# Altium project CompleteController.PrjPcb (part 2 of 2)

## Sheet SH5 - ARMCONTROLS.SchDoc
size Letter; Organization: UW Robotics; Address1: 200 University Avenue; Address2: Waterloo; Address3: Ontario; Address4: Canada N2L 3G6
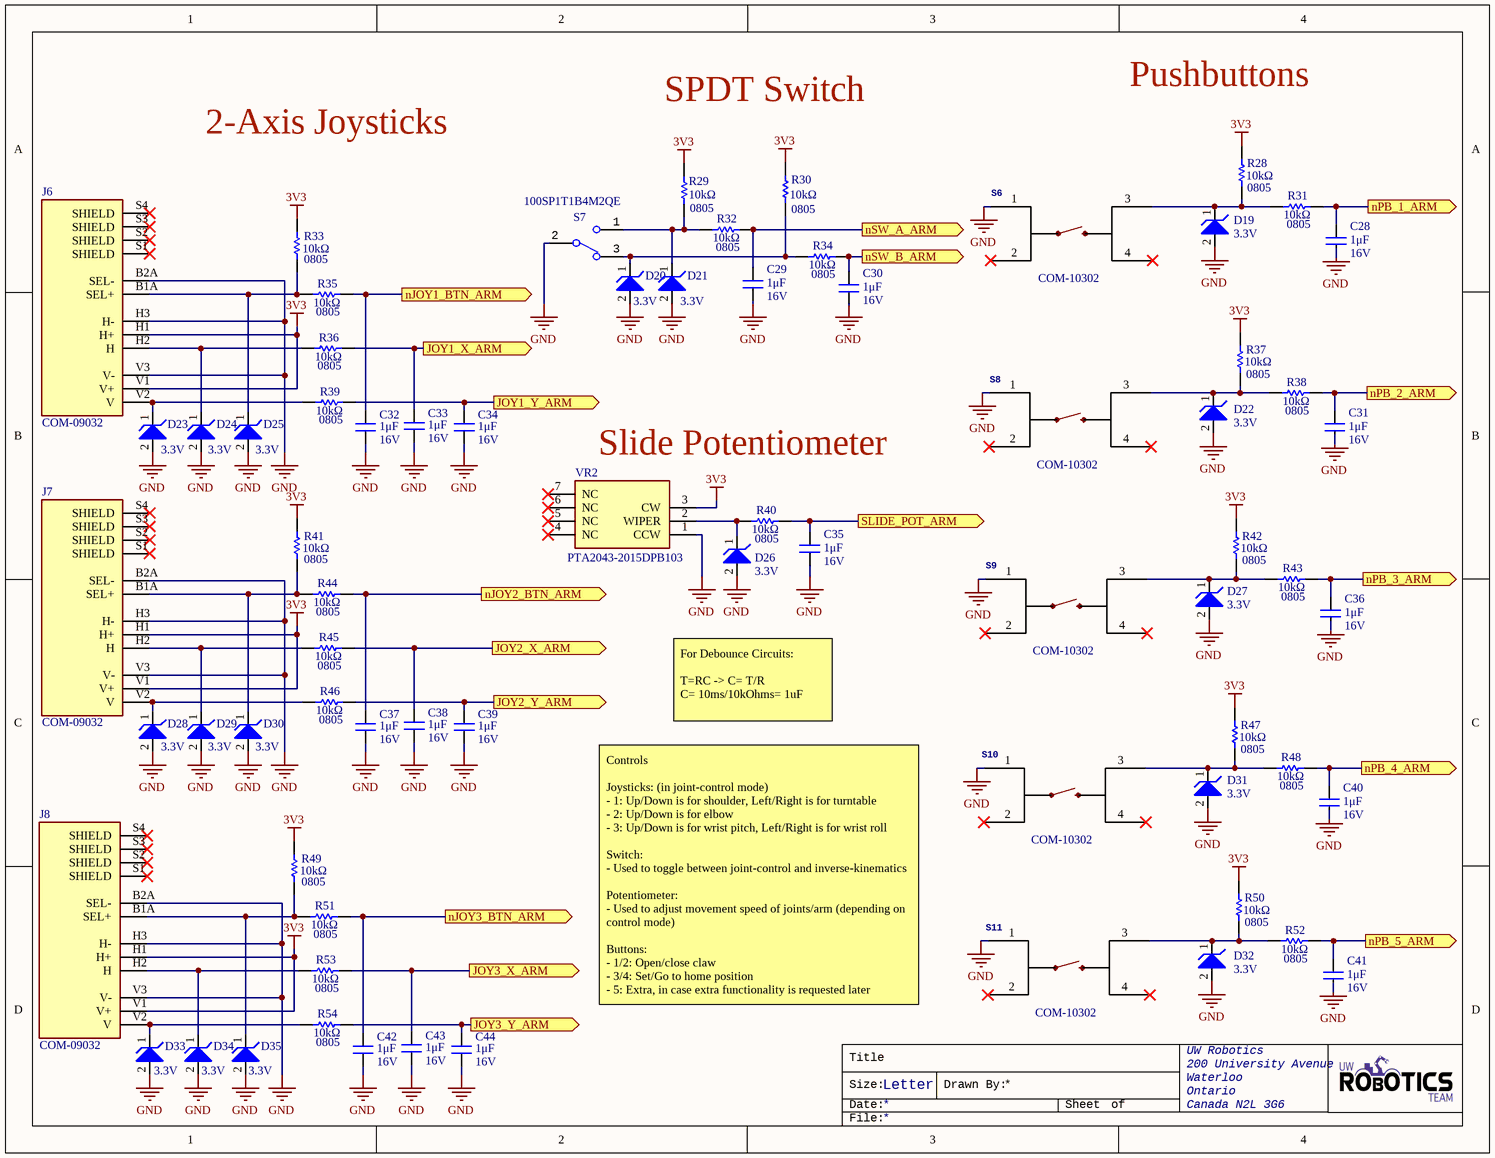
[diagram p4: SH5 - ARMCONTROLS.SchDoc]

### Parts
C28  value 1μF  Voltage Rating: 16V  [CAP2012]  (hidden comment: CAP_1uF_16V_0805)
C29  value 1μF  Voltage Rating: 16V  [CAP2012]  (hidden comment: CAP_1uF_16V_0805)
C30  value 1μF  Voltage Rating: 16V  [CAP2012]  (hidden comment: CAP_1uF_16V_0805)
C31  value 1μF  Voltage Rating: 16V  [CAP2012]  (hidden comment: CAP_1uF_16V_0805)
C32  value 1μF  Voltage Rating: 16V  [CAP2012]  (hidden comment: CAP_1uF_16V_0805)
C33  value 1μF  Voltage Rating: 16V  [CAP2012]  (hidden comment: CAP_1uF_16V_0805)
C34  value 1μF  Voltage Rating: 16V  [CAP2012]  (hidden comment: CAP_1uF_16V_0805)
C35  value 1μF  Voltage Rating: 16V  [CAP2012]  (hidden comment: CAP_1uF_16V_0805)
C36  value 1μF  Voltage Rating: 16V  [CAP2012]  (hidden comment: CAP_1uF_16V_0805)
C37  value 1μF  Voltage Rating: 16V  [CAP2012]  (hidden comment: CAP_1uF_16V_0805)
C38  value 1μF  Voltage Rating: 16V  [CAP2012]  (hidden comment: CAP_1uF_16V_0805)
C39  value 1μF  Voltage Rating: 16V  [CAP2012]  (hidden comment: CAP_1uF_16V_0805)
C40  value 1μF  Voltage Rating: 16V  [CAP2012]  (hidden comment: CAP_1uF_16V_0805)
C41  value 1μF  Voltage Rating: 16V  [CAP2012]  (hidden comment: CAP_1uF_16V_0805)
C42  value 1μF  Voltage Rating: 16V  [CAP2012]  (hidden comment: CAP_1uF_16V_0805)
C43  value 1μF  Voltage Rating: 16V  [CAP2012]  (hidden comment: CAP_1uF_16V_0805)
C44  value 1μF  Voltage Rating: 16V  [CAP2012]  (hidden comment: CAP_1uF_16V_0805)
D19  Reverse Standoff Voltage: 3.3V  [SOD523]  (hidden comment: TVS_DIODE_UNIDIR_3.3V)
D20  Reverse Standoff Voltage: 3.3V  [SOD523]  (hidden comment: TVS_DIODE_UNIDIR_3.3V)
D21  Reverse Standoff Voltage: 3.3V  [SOD523]  (hidden comment: TVS_DIODE_UNIDIR_3.3V)
D22  Reverse Standoff Voltage: 3.3V  [SOD523]  (hidden comment: TVS_DIODE_UNIDIR_3.3V)
D23  Reverse Standoff Voltage: 3.3V  [SOD523]  (hidden comment: TVS_DIODE_UNIDIR_3.3V)
D24  Reverse Standoff Voltage: 3.3V  [SOD523]  (hidden comment: TVS_DIODE_UNIDIR_3.3V)
D25  Reverse Standoff Voltage: 3.3V  [SOD523]  (hidden comment: TVS_DIODE_UNIDIR_3.3V)
D26  Reverse Standoff Voltage: 3.3V  [SOD523]  (hidden comment: TVS_DIODE_UNIDIR_3.3V)
D27  Reverse Standoff Voltage: 3.3V  [SOD523]  (hidden comment: TVS_DIODE_UNIDIR_3.3V)
D28  Reverse Standoff Voltage: 3.3V  [SOD523]  (hidden comment: TVS_DIODE_UNIDIR_3.3V)
D29  Reverse Standoff Voltage: 3.3V  [SOD523]  (hidden comment: TVS_DIODE_UNIDIR_3.3V)
D30  Reverse Standoff Voltage: 3.3V  [SOD523]  (hidden comment: TVS_DIODE_UNIDIR_3.3V)
D31  Reverse Standoff Voltage: 3.3V  [SOD523]  (hidden comment: TVS_DIODE_UNIDIR_3.3V)
D32  Reverse Standoff Voltage: 3.3V  [SOD523]  (hidden comment: TVS_DIODE_UNIDIR_3.3V)
D33  Reverse Standoff Voltage: 3.3V  [SOD523]  (hidden comment: TVS_DIODE_UNIDIR_3.3V)
D34  Reverse Standoff Voltage: 3.3V  [SOD523]  (hidden comment: TVS_DIODE_UNIDIR_3.3V)
D35  Reverse Standoff Voltage: 3.3V  [SOD523]  (hidden comment: TVS_DIODE_UNIDIR_3.3V)
J6  Manufacturer Part Number 1: COM-09032  [2_AXIS_JOYSTICK]  (hidden comment: 2_AXIS_JOYSTICK)
J7  Manufacturer Part Number 1: COM-09032  [2_AXIS_JOYSTICK]  (hidden comment: 2_AXIS_JOYSTICK)
J8  Manufacturer Part Number 1: COM-09032  [2_AXIS_JOYSTICK]  (hidden comment: 2_AXIS_JOYSTICK)
R28  value 10kΩ  Case Code (Imperial): 0805  [RESC0805]  (hidden comment: RES_10kΩ_0805_5%)
R29  value 10kΩ  Case Code (Imperial): 0805  [RESC0805]  (hidden comment: RES_10kΩ_0805_5%)
R30  value 10kΩ  Case Code (Imperial): 0805  [RESC0805]  (hidden comment: RES_10kΩ_0805_5%)
R31  value 10kΩ  Case Code (Imperial): 0805  [RESC0805]  (hidden comment: RES_10kΩ_0805_5%)
R32  value 10kΩ  Case Code (Imperial): 0805  [RESC0805]  (hidden comment: RES_10kΩ_0805_5%)
R33  value 10kΩ  Case Code (Imperial): 0805  [RESC0805]  (hidden comment: RES_10kΩ_0805_5%)
R34  value 10kΩ  Case Code (Imperial): 0805  [RESC0805]  (hidden comment: RES_10kΩ_0805_5%)
R35  value 10kΩ  Case Code (Imperial): 0805  [RESC0805]  (hidden comment: RES_10kΩ_0805_5%)
R36  value 10kΩ  Case Code (Imperial): 0805  [RESC0805]  (hidden comment: RES_10kΩ_0805_5%)
R37  value 10kΩ  Case Code (Imperial): 0805  [RESC0805]  (hidden comment: RES_10kΩ_0805_5%)
R38  value 10kΩ  Case Code (Imperial): 0805  [RESC0805]  (hidden comment: RES_10kΩ_0805_5%)
R39  value 10kΩ  Case Code (Imperial): 0805  [RESC0805]  (hidden comment: RES_10kΩ_0805_5%)
R40  value 10kΩ  Case Code (Imperial): 0805  [RESC0805]  (hidden comment: RES_10kΩ_0805_5%)
R41  value 10kΩ  Case Code (Imperial): 0805  [RESC0805]  (hidden comment: RES_10kΩ_0805_5%)
R42  value 10kΩ  Case Code (Imperial): 0805  [RESC0805]  (hidden comment: RES_10kΩ_0805_5%)
R43  value 10kΩ  Case Code (Imperial): 0805  [RESC0805]  (hidden comment: RES_10kΩ_0805_5%)
R44  value 10kΩ  Case Code (Imperial): 0805  [RESC0805]  (hidden comment: RES_10kΩ_0805_5%)
R45  value 10kΩ  Case Code (Imperial): 0805  [RESC0805]  (hidden comment: RES_10kΩ_0805_5%)
R46  value 10kΩ  Case Code (Imperial): 0805  [RESC0805]  (hidden comment: RES_10kΩ_0805_5%)
R47  value 10kΩ  Case Code (Imperial): 0805  [RESC0805]  (hidden comment: RES_10kΩ_0805_5%)
R48  value 10kΩ  Case Code (Imperial): 0805  [RESC0805]  (hidden comment: RES_10kΩ_0805_5%)
R49  value 10kΩ  Case Code (Imperial): 0805  [RESC0805]  (hidden comment: RES_10kΩ_0805_5%)
R50  value 10kΩ  Case Code (Imperial): 0805  [RESC0805]  (hidden comment: RES_10kΩ_0805_5%)
R51  value 10kΩ  Case Code (Imperial): 0805  [RESC0805]  (hidden comment: RES_10kΩ_0805_5%)
R52  value 10kΩ  Case Code (Imperial): 0805  [RESC0805]  (hidden comment: RES_10kΩ_0805_5%)
R53  value 10kΩ  Case Code (Imperial): 0805  [RESC0805]  (hidden comment: RES_10kΩ_0805_5%)
R54  value 10kΩ  Case Code (Imperial): 0805  [RESC0805]  (hidden comment: RES_10kΩ_0805_5%)
S6  Manufacturer Part Number 1: COM-10302  [TACTILE_SWITCH_PTH_12MM]  (hidden comment: Pushbutton)
S7  100SP1T1B4M2QE  [100SP1T1B4M2QE]
S8  Manufacturer Part Number 1: COM-10302  [TACTILE_SWITCH_PTH_12MM]  (hidden comment: Pushbutton)
S9  Manufacturer Part Number 1: COM-10302  [TACTILE_SWITCH_PTH_12MM]  (hidden comment: Pushbutton)
S10  Manufacturer Part Number 1: COM-10302  [TACTILE_SWITCH_PTH_12MM]  (hidden comment: Pushbutton)
S11  Manufacturer Part Number 1: COM-10302  [TACTILE_SWITCH_PTH_12MM]  (hidden comment: Pushbutton)
VR2  Manufacturer Part Number 1: PTA2043-2015DPB103  [PTA20432015CPB103]  (hidden comment: POT_10K_SLIDE)

### Ports
JOY1_X_ARM (out), JOY1_Y_ARM (out), JOY2_X_ARM (out), JOY2_Y_ARM (out), JOY3_X_ARM (out), JOY3_Y_ARM (out), nJOY1_BTN_ARM (out), nJOY2_BTN_ARM (out), nJOY3_BTN_ARM (out), nPB_1_ARM (out), nPB_2_ARM (out), nPB_3_ARM (out), nPB_4_ARM (out), nPB_5_ARM (out), nSW_A_ARM (out), nSW_B_ARM (out), SLIDE_POT_ARM (out)

### Nets
3V3: J6.H1(H+) J6.V1(V+) J7.H1(H+) J7.V1(V+) J8.H1(H+) J8.V1(V+) R28.1 R29.1 R30.1 R33.1 R37.1 R41.1 R42.1 R47.1 R49.1 R50.1 VR2.3(CW)
GND: C28.1 C29.1 C30.1 C31.1 C32.1 C33.1 C34.1 C35.1 C36.1 C37.1 C38.1 C39.1 C40.1 C41.1 C42.1 C43.1 C44.1 D19.2 D20.2 D21.2 D22.2 D23.2 D24.2 D25.2 D26.2 D27.2 D28.2 D29.2 D30.2 D31.2 D32.2 D33.2 D34.2 D35.2 J6.B2A(SEL-) J6.H3(H-) J6.V3(V-) J7.B2A(SEL-) J7.H3(H-) J7.V3(V-) J8.B2A(SEL-) J8.H3(H-) J8.V3(V-) S6.1 S7.2 S8.1 S9.1 S10.1 S11.1 VR2.1(CCW)
NetC28_2: C28.2 R31.2 ; port nPB_1_ARM
NetC29_2: C29.2 R32.2 ; port nSW_A_ARM
NetC30_2: C30.2 R34.2 ; port nSW_B_ARM
NetC31_2: C31.2 R38.2 ; port nPB_2_ARM
NetC32_2: C32.2 R35.2 ; port nJOY1_BTN_ARM
NetC33_2: C33.2 R36.2 ; port JOY1_X_ARM
NetC34_2: C34.2 R39.2 ; port JOY1_Y_ARM
NetC35_2: C35.2 R40.2 ; port SLIDE_POT_ARM
NetC36_2: C36.2 R43.2 ; port nPB_3_ARM
NetC37_2: C37.2 R44.2 ; port nJOY2_BTN_ARM
NetC38_2: C38.2 R45.2 ; port JOY2_X_ARM
NetC39_2: C39.2 R46.2 ; port JOY2_Y_ARM
NetC40_2: C40.2 R48.2 ; port nPB_4_ARM
NetC41_2: C41.2 R52.2 ; port nPB_5_ARM
NetC42_2: C42.2 R51.2 ; port nJOY3_BTN_ARM
NetC43_2: C43.2 R53.2 ; port JOY3_X_ARM
NetC44_2: C44.2 R54.2 ; port JOY3_Y_ARM
NetD19_1: D19.1 R28.2 R31.1 S6.3
NetD20_1: D20.1 R30.2 R34.1 S7.3
NetD21_1: D21.1 R29.2 R32.1 S7.1
NetD22_1: D22.1 R37.2 R38.1 S8.3
NetD23_1: D23.1 J6.V2(V) R39.1
NetD24_1: D24.1 J6.H2(H) R36.1
NetD25_1: D25.1 J6.B1A(SEL+) R33.2 R35.1
NetD26_1: D26.1 R40.1 VR2.2(WIPER)
NetD27_1: D27.1 R42.2 R43.1 S9.3
NetD28_1: D28.1 J7.V2(V) R46.1
NetD29_1: D29.1 J7.H2(H) R45.1
NetD30_1: D30.1 J7.B1A(SEL+) R41.2 R44.1
NetD31_1: D31.1 R47.2 R48.1 S10.3
NetD32_1: D32.1 R50.2 R52.1 S11.3
NetD33_1: D33.1 J8.V2(V) R54.1
NetD34_1: D34.1 J8.H2(H) R53.1
NetD35_1: D35.1 J8.B1A(SEL+) R49.2 R51.1

Not connected (* = marked no-connect by the designer): J6 S1(SHIELD)* S2(SHIELD)* S3(SHIELD)* S4(SHIELD)*; J7 S1(SHIELD)* S2(SHIELD)* S3(SHIELD)* S4(SHIELD)*; J8 S1(SHIELD)* S2(SHIELD)* S3(SHIELD)* S4(SHIELD)*; S6 2* 4*; S8 2* 4*; S9 2* 4*; S10 2* 4*; S11 2* 4*; VR2 4(NC)* 5(NC)* 6(NC)* 7(NC)*

### Notes on the sheet
- Pushbuttons
- 2-Axis Joysticks
- SPDT Switch
- (near VR2) Slide Potentiometer
- For Debounce Circuits:
  T=RC -> C= T/R
  C= 10ms/10kOhms= 1uF
- Controls
  Joysticks: (in joint-control mode)
  - 1: Up/Down is for shoulder, Left/Right is for turntable
  - 2: Up/Down is for elbow
  - 3: Up/Down is for wrist pitch, Left/Right is for wrist roll
  Switch:
  - Used to toggle between joint-control and inverse-kinematics
  Potentiometer:
  - Used to adjust movement speed of joints/arm (depending on control mode)
  Buttons:
  - 1/2: Open/close claw
  - 3/4: Set/Go to home position
  - 5: Extra, in case extra functionality is requested later
- Title
- Size:
- Date:
- Letter
- Drawn By:
- Sheet
- of
- File:

### Library data of the parts
C28-C44 = CAP_1uF_16V_0805: CAP CER 1UF 16V X7R 0805; Manufacturer 1: Yageo; Manufacturer Part Number 1: CC0805KKX7R7BB105; Tolerance: 10%; Mount: Surface Mount; Case Code (Metric): 2012; Case Code (Imperial): 0805; Min Operating Temperature: -55°C; Max Operating Temperature: 125°C; Dielectric: X7R; Termination: SMD/SMT; Supplier 1: Digi-Key; Supplier Part Number 1: 311-1365-1-ND; Package: 0805 (2012 Metric)
D19-D35 = TVS_DIODE_UNIDIR_3.3V: TVS DIODE 3.3V 14.1V SOD523. Used to protect each connector input line going into the MCU.; Manufacturer 1: ON Semiconductor; Manufacturer Part Number 1: ESD5Z3.3T1G; Reverse Breakdown Voltage: 5V; Peak Pulse Power: 158W; Power Line Protection: No; Number of Channels: 1; Polarity: Unidirectional; Peak Pulse Current: 11.2A; Supplier 1: Digi-Key; Mount: Surface Mount; Number of Pins: 2; Min Operating Temperature: -55°C; Max Operating Temperature: 150°C; Clamping Voltage: 14.1V; Composition: Zener; Supplier Part Number 1: ESD5Z3.3T1GOSCT-ND
J6-J8 = 2_AXIS_JOYSTICK: JOYSTICK 10K OHM 2 AXIS TH; Manufacturer 1: SparkFun; Supplier 1: Digi-Key; Supplier Part Number 1: 1568-1526-ND
R28-R54 = RES_10kΩ_0805_5%: RES 10K OHM 5% 1/8W 0805; Manufacturer 1: Panasonic Electronic Components; Manufacturer Part Number 1: ERJ-6GEYJ103V; Supplier 1: Digi-Key; Supplier Part Number 1: P10KACT-ND
S6 S8-S11 = MOMENTARY_SWITCH_TH: TACTILE MOMENTARY PUSHBUTTON SPST; Manufacturer 1: SparkFun; SymbolName_1: SWITCH-MOMENTARY-2; PROD_ID: SWCH-09185; SF_SKU: COM-09190; Package: TACTILE_SWITCH_PTH_12MM; Supplier 1: Digi-Key; Mount: Through Hole; Throw Configuration: SPST; Termination: PC Pin; Supplier Part Number 1: 1568-1332-ND
S7 = SW_SPDT: SWITCH TOGGLE SPDT 5A 120V; Manufacturer 1: E-Switch; Actuator Material: Brass,Chrome; Switch Function: On-On; Voltage Rating (DC): 28V; Illumination Type: Non-Illuminated,Illuminated; Actuator Type: Standard Round; Electrical Life: 40000Cycles; Actuator Length: 12.19mm; Supplier 1: Digi-Key; Manufacturer Part Number 1: 100SP1T1B4M2QE; Mount: Through Hole; Contact Material: Silver; Contact Plating: Silver; Min Operating Temperature: -30°C; Max Operating Temperature: 85°C; Current Rating: 5A; Voltage Rating (AC): 120V; Orientation: Vertical; Termination: PC Pin; Throw Configuration: SPDT; Supplier Part Number 1: EG2355-ND
VR2 = POT_10K_SLIDE: SLIDE POT 10K OHM 0.1W TOP 20MM; Manufacturer 1: Bourns; Max Power Dissipation: 100mW; Tolerance: 20%; Resistance: 10kR; Power Rating: 50mW; Number of Turns: 1; Hole Diameter: 1.2mm; Supplier 1: Digi-Key; Stock 1: 927; Pricing 1: 1=1.29000, 10=1.14000, 25=1.02600, 50=0.98800, 100=0.95000, 250=0.89300, 500=0.76000, 1000=0.70300, 5000=0.57760 (USD); RoHS: Yes; Mount: Through Hole; Min Operating Temperature: -10°C; Max Operating Temperature: 50°C; Packaging: Bulk; Composition: Potentiometer; Type: Potentiometer; Termination: Pin; Taper: Linear; Military Standard: Not; Package Quantity: 100; Length: 35mm; Height: 0.256inch; Width: 0.354inch; Depth: 9mm; ComponentLink1URL: https://datasheet.ciiva.com/6248/pta-6248511.pdf?src-supplier=Digi-Key; ComponentLink1Description: https://datasheet.ciiva.com/6248/pta-6248511.pdf?src-supplier=Digi-Key; Supplier Part Number 1: PTA2043-2015DPB103-ND; Radiation Hardening: No

## Sheet SH6 - SCIENCECONTROLS.SchDoc
size Letter; Organization: UW Robotics; Address1: 200 University Avenue; Address2: Waterloo; Address3: Ontario; Address4: Canada N2L 3G6
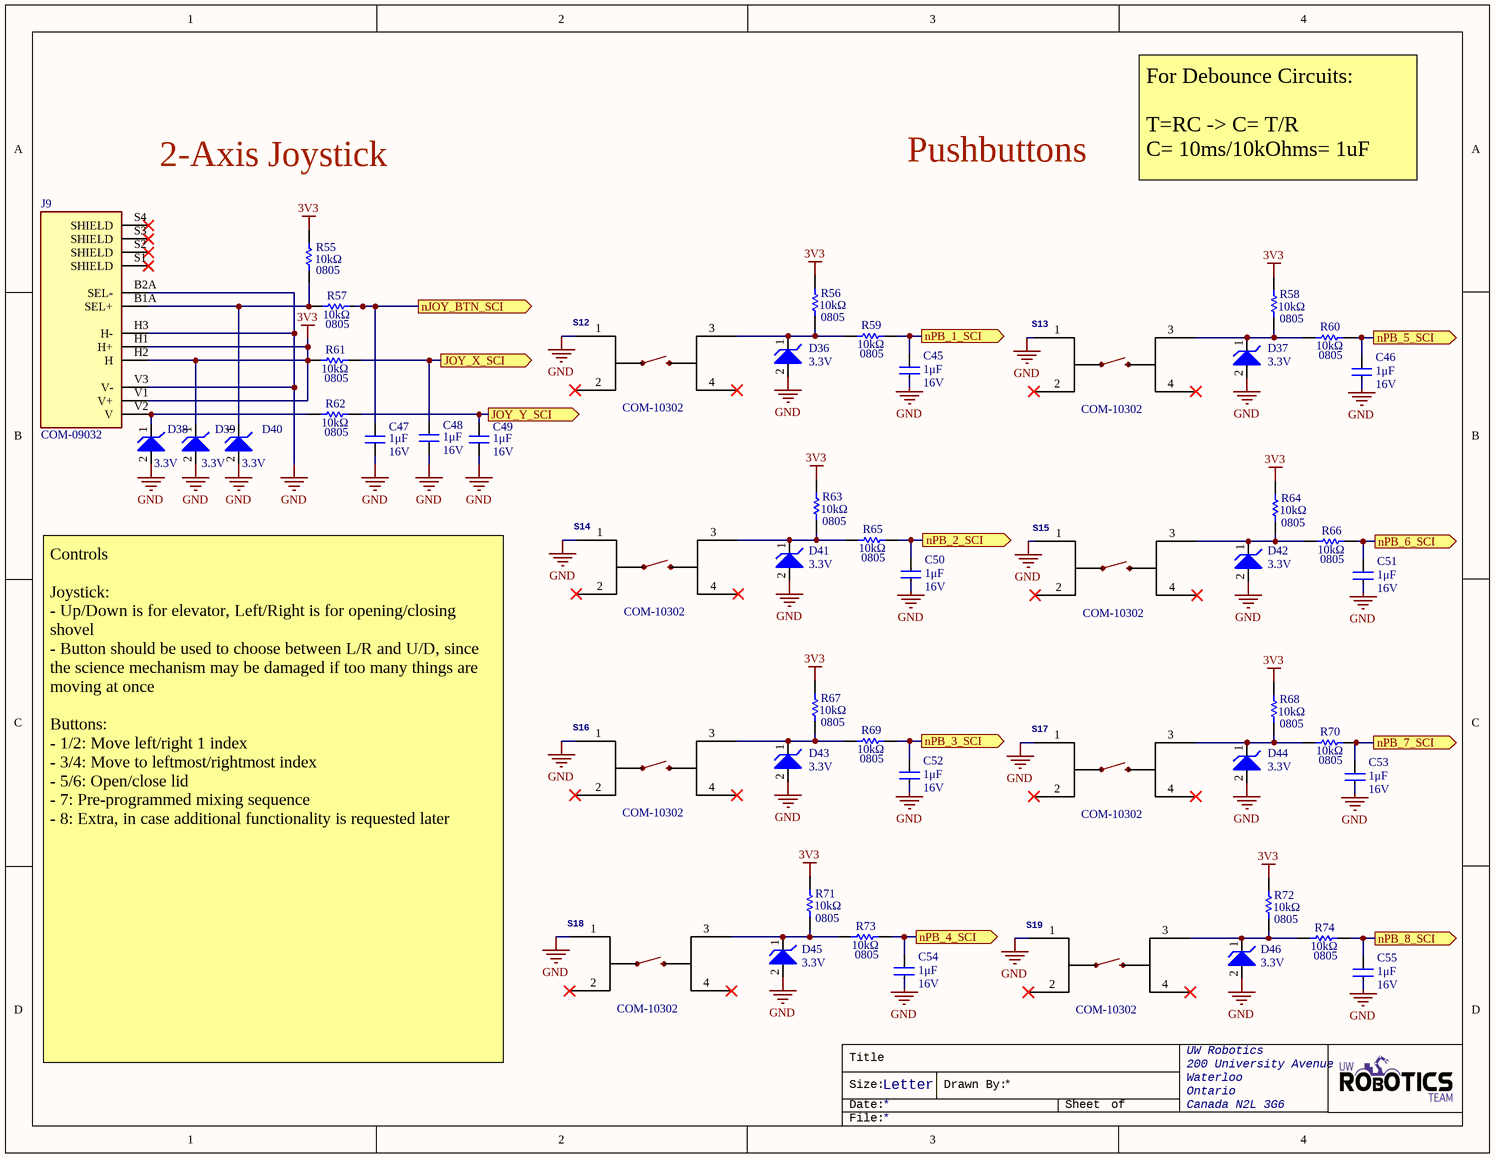
[diagram p5: SH6 - SCIENCECONTROLS.SchDoc]

### Parts
C45  value 1μF  Voltage Rating: 16V  [CAP2012]  (hidden comment: CAP_1uF_16V_0805)
C46  value 1μF  Voltage Rating: 16V  [CAP2012]  (hidden comment: CAP_1uF_16V_0805)
C47  value 1μF  Voltage Rating: 16V  [CAP2012]  (hidden comment: CAP_1uF_16V_0805)
C48  value 1μF  Voltage Rating: 16V  [CAP2012]  (hidden comment: CAP_1uF_16V_0805)
C49  value 1μF  Voltage Rating: 16V  [CAP2012]  (hidden comment: CAP_1uF_16V_0805)
C50  value 1μF  Voltage Rating: 16V  [CAP2012]  (hidden comment: CAP_1uF_16V_0805)
C51  value 1μF  Voltage Rating: 16V  [CAP2012]  (hidden comment: CAP_1uF_16V_0805)
C52  value 1μF  Voltage Rating: 16V  [CAP2012]  (hidden comment: CAP_1uF_16V_0805)
C53  value 1μF  Voltage Rating: 16V  [CAP2012]  (hidden comment: CAP_1uF_16V_0805)
C54  value 1μF  Voltage Rating: 16V  [CAP2012]  (hidden comment: CAP_1uF_16V_0805)
C55  value 1μF  Voltage Rating: 16V  [CAP2012]  (hidden comment: CAP_1uF_16V_0805)
D36  Reverse Standoff Voltage: 3.3V  [SOD523]  (hidden comment: TVS_DIODE_UNIDIR_3.3V)
D37  Reverse Standoff Voltage: 3.3V  [SOD523]  (hidden comment: TVS_DIODE_UNIDIR_3.3V)
D38  Reverse Standoff Voltage: 3.3V  [SOD523]  (hidden comment: TVS_DIODE_UNIDIR_3.3V)
D39  Reverse Standoff Voltage: 3.3V  [SOD523]  (hidden comment: TVS_DIODE_UNIDIR_3.3V)
D40  Reverse Standoff Voltage: 3.3V  [SOD523]  (hidden comment: TVS_DIODE_UNIDIR_3.3V)
D41  Reverse Standoff Voltage: 3.3V  [SOD523]  (hidden comment: TVS_DIODE_UNIDIR_3.3V)
D42  Reverse Standoff Voltage: 3.3V  [SOD523]  (hidden comment: TVS_DIODE_UNIDIR_3.3V)
D43  Reverse Standoff Voltage: 3.3V  [SOD523]  (hidden comment: TVS_DIODE_UNIDIR_3.3V)
D44  Reverse Standoff Voltage: 3.3V  [SOD523]  (hidden comment: TVS_DIODE_UNIDIR_3.3V)
D45  Reverse Standoff Voltage: 3.3V  [SOD523]  (hidden comment: TVS_DIODE_UNIDIR_3.3V)
D46  Reverse Standoff Voltage: 3.3V  [SOD523]  (hidden comment: TVS_DIODE_UNIDIR_3.3V)
J9  Manufacturer Part Number 1: COM-09032  [2_AXIS_JOYSTICK]  (hidden comment: 2_AXIS_JOYSTICK)
R55  value 10kΩ  Case Code (Imperial): 0805  [RESC0805]  (hidden comment: RES_10kΩ_0805_5%)
R56  value 10kΩ  Case Code (Imperial): 0805  [RESC0805]  (hidden comment: RES_10kΩ_0805_5%)
R57  value 10kΩ  Case Code (Imperial): 0805  [RESC0805]  (hidden comment: RES_10kΩ_0805_5%)
R58  value 10kΩ  Case Code (Imperial): 0805  [RESC0805]  (hidden comment: RES_10kΩ_0805_5%)
R59  value 10kΩ  Case Code (Imperial): 0805  [RESC0805]  (hidden comment: RES_10kΩ_0805_5%)
R60  value 10kΩ  Case Code (Imperial): 0805  [RESC0805]  (hidden comment: RES_10kΩ_0805_5%)
R61  value 10kΩ  Case Code (Imperial): 0805  [RESC0805]  (hidden comment: RES_10kΩ_0805_5%)
R62  value 10kΩ  Case Code (Imperial): 0805  [RESC0805]  (hidden comment: RES_10kΩ_0805_5%)
R63  value 10kΩ  Case Code (Imperial): 0805  [RESC0805]  (hidden comment: RES_10kΩ_0805_5%)
R64  value 10kΩ  Case Code (Imperial): 0805  [RESC0805]  (hidden comment: RES_10kΩ_0805_5%)
R65  value 10kΩ  Case Code (Imperial): 0805  [RESC0805]  (hidden comment: RES_10kΩ_0805_5%)
R66  value 10kΩ  Case Code (Imperial): 0805  [RESC0805]  (hidden comment: RES_10kΩ_0805_5%)
R67  value 10kΩ  Case Code (Imperial): 0805  [RESC0805]  (hidden comment: RES_10kΩ_0805_5%)
R68  value 10kΩ  Case Code (Imperial): 0805  [RESC0805]  (hidden comment: RES_10kΩ_0805_5%)
R69  value 10kΩ  Case Code (Imperial): 0805  [RESC0805]  (hidden comment: RES_10kΩ_0805_5%)
R70  value 10kΩ  Case Code (Imperial): 0805  [RESC0805]  (hidden comment: RES_10kΩ_0805_5%)
R71  value 10kΩ  Case Code (Imperial): 0805  [RESC0805]  (hidden comment: RES_10kΩ_0805_5%)
R72  value 10kΩ  Case Code (Imperial): 0805  [RESC0805]  (hidden comment: RES_10kΩ_0805_5%)
R73  value 10kΩ  Case Code (Imperial): 0805  [RESC0805]  (hidden comment: RES_10kΩ_0805_5%)
R74  value 10kΩ  Case Code (Imperial): 0805  [RESC0805]  (hidden comment: RES_10kΩ_0805_5%)
S12  Manufacturer Part Number 1: COM-10302  [TACTILE_SWITCH_PTH_12MM]  (hidden comment: Pushbutton)
S13  Manufacturer Part Number 1: COM-10302  [TACTILE_SWITCH_PTH_12MM]  (hidden comment: Pushbutton)
S14  Manufacturer Part Number 1: COM-10302  [TACTILE_SWITCH_PTH_12MM]  (hidden comment: Pushbutton)
S15  Manufacturer Part Number 1: COM-10302  [TACTILE_SWITCH_PTH_12MM]  (hidden comment: Pushbutton)
S16  Manufacturer Part Number 1: COM-10302  [TACTILE_SWITCH_PTH_12MM]  (hidden comment: Pushbutton)
S17  Manufacturer Part Number 1: COM-10302  [TACTILE_SWITCH_PTH_12MM]  (hidden comment: Pushbutton)
S18  Manufacturer Part Number 1: COM-10302  [TACTILE_SWITCH_PTH_12MM]  (hidden comment: Pushbutton)
S19  Manufacturer Part Number 1: COM-10302  [TACTILE_SWITCH_PTH_12MM]  (hidden comment: Pushbutton)

### Ports
JOY_X_SCI (out), JOY_Y_SCI (out), nJOY_BTN_SCI (out), nPB_1_SCI (out), nPB_2_SCI (out), nPB_3_SCI (out), nPB_4_SCI (out), nPB_5_SCI (out), nPB_6_SCI (out), nPB_7_SCI (out), nPB_8_SCI (out)

### Nets
3V3: D39.1 J9.H1(H+) J9.H2(H) J9.V1(V+) R55.1 R56.1 R58.1 R61.1 R63.1 R64.1 R67.1 R68.1 R71.1 R72.1
GND: C45.1 C46.1 C47.1 C48.1 C49.1 C50.1 C51.1 C52.1 C53.1 C54.1 C55.1 D36.2 D37.2 D38.2 D39.2 D40.2 D41.2 D42.2 D43.2 D44.2 D45.2 D46.2 J9.B2A(SEL-) J9.H3(H-) J9.V3(V-) S12.1 S13.1 S14.1 S15.1 S16.1 S17.1 S18.1 S19.1
NetC45_2: C45.2 R59.2 ; port nPB_1_SCI
NetC46_2: C46.2 R60.2 ; port nPB_5_SCI
NetC47_2: C47.2 R57.2 ; port nJOY_BTN_SCI
NetC48_2: C48.2 R61.2 ; port JOY_X_SCI
NetC49_2: C49.2 R62.2 ; port JOY_Y_SCI
NetC50_2: C50.2 R65.2 ; port nPB_2_SCI
NetC51_2: C51.2 R66.2 ; port nPB_6_SCI
NetC52_2: C52.2 R69.2 ; port nPB_3_SCI
NetC53_2: C53.2 R70.2 ; port nPB_7_SCI
NetC54_2: C54.2 R73.2 ; port nPB_4_SCI
NetC55_2: C55.2 R74.2 ; port nPB_8_SCI
NetD36_1: D36.1 R56.2 R59.1 S12.3
NetD37_1: D37.1 R58.2 R60.1 S13.3
NetD38_1: D38.1 J9.V2(V) R62.1
NetD40_1: D40.1 J9.B1A(SEL+) R55.2 R57.1
NetD41_1: D41.1 R63.2 R65.1 S14.3
NetD42_1: D42.1 R64.2 R66.1 S15.3
NetD43_1: D43.1 R67.2 R69.1 S16.3
NetD44_1: D44.1 R68.2 R70.1 S17.3
NetD45_1: D45.1 R71.2 R73.1 S18.3
NetD46_1: D46.1 R72.2 R74.1 S19.3

Not connected (* = marked no-connect by the designer): J9 S1(SHIELD)* S2(SHIELD)* S3(SHIELD)* S4(SHIELD)*; S12 2* 4*; S13 2* 4*; S14 2* 4*; S15 2* 4*; S16 2* 4*; S17 2* 4*; S18 2* 4*; S19 2* 4*

### Notes on the sheet
- Pushbuttons
- 2-Axis Joystick
- For Debounce Circuits:
  T=RC -> C= T/R
  C= 10ms/10kOhms= 1uF
- Controls
  Joystick:
  - Up/Down is for elevator, Left/Right is for opening/closing shovel
  - Button should be used to choose between L/R and U/D, since the science mechanism may be damaged if too many things are moving at once
  Buttons:
  - 1/2: Move left/right 1 index
  - 3/4: Move to leftmost/rightmost index
  - 5/6: Open/close lid
  - 7: Pre-programmed mixing sequence
  - 8: Extra, in case additional functionality is requested later
- Title
- Size:
- Date:
- Letter
- Drawn By:
- Sheet
- of
- File:

### Library data of the parts
C45-C55 = CAP_1uF_16V_0805: as C28 on sheet SH5 - ARMCONTROLS; Mount: Surface Mount; Case Code (Metric): 2012; Case Code (Imperial): 0805; Min Operating Temperature: -55°C; Max Operating Temperature: 125°C; Dielectric: X7R; Termination: SMD/SMT; Supplier 1: Digi-Key; Supplier Part Number 1: 311-1365-1-ND; Package: 0805 (2012 Metric)
D36-D46 = TVS_DIODE_UNIDIR_3.3V: as D19 on sheet SH5 - ARMCONTROLS; Supplier 1: Digi-Key; Mount: Surface Mount; Number of Pins: 2; Min Operating Temperature: -55°C; Max Operating Temperature: 150°C; Clamping Voltage: 14.1V; Composition: Zener; Supplier Part Number 1: ESD5Z3.3T1GOSCT-ND
J9 = 2_AXIS_JOYSTICK: as J6 on sheet SH5 - ARMCONTROLS; Supplier 1: Digi-Key; Supplier Part Number 1: 1568-1526-ND
R55-R74 = RES_10kΩ_0805_5%: as R28 on sheet SH5 - ARMCONTROLS; Supplier 1: Digi-Key; Supplier Part Number 1: P10KACT-ND
S12-S19 = MOMENTARY_SWITCH_TH: as S6 on sheet SH5 - ARMCONTROLS; Package: TACTILE_SWITCH_PTH_12MM; Supplier 1: Digi-Key; Mount: Through Hole; Throw Configuration: SPST; Termination: PC Pin; Supplier Part Number 1: 1568-1332-ND

## Nets that join several sheets
3V3: SH1 - POWER (C3.2 R1.2 TP2.1 U1.2), SH2 - MCU (17 pins), SH4 - GIMBDRIVECONTROLS (14 pins), SH5 - ARMCONTROLS (17 pins), SH6 - SCIENCECONTROLS (14 pins)
GND: SH1 - POWER (9 pins), SH2 - MCU (24 pins), SH3 - USB (5 pins), SH4 - GIMBDRIVECONTROLS (32 pins), SH5 - ARMCONTROLS (50 pins), SH6 - SCIENCECONTROLS (33 pins)
NetC17_2: SH2 - MCU (U2.9), SH4 - GIMBDRIVECONTROLS (C17.2 R11.2)
NetC18_2: SH2 - MCU (U2.43), SH4 - GIMBDRIVECONTROLS (C18.2 R13.2)
NetC19_2: SH2 - MCU (U2.15), SH4 - GIMBDRIVECONTROLS (C19.2 R14.2)
NetC20_2: SH2 - MCU (U2.16), SH4 - GIMBDRIVECONTROLS (C20.2 R15.2)
NetC21_2: SH2 - MCU (U2.42), SH4 - GIMBDRIVECONTROLS (C21.2 R17.2)
NetC22_2: SH2 - MCU (U2.41), SH4 - GIMBDRIVECONTROLS (C22.2 R22.2)
NetC23_2: SH2 - MCU (U2.8), SH4 - GIMBDRIVECONTROLS (C23.2 R19.2)
NetC24_2: SH2 - MCU (U2.14), SH4 - GIMBDRIVECONTROLS (C24.2 R21.2)
NetC25_2: SH2 - MCU (U2.11), SH4 - GIMBDRIVECONTROLS (C25.2 R23.2)
NetC26_2: SH2 - MCU (U2.61), SH4 - GIMBDRIVECONTROLS (C26.2 R26.2)
NetC27_2: SH2 - MCU (U2.59), SH4 - GIMBDRIVECONTROLS (C27.2 R27.2)
NetC28_2: SH2 - MCU (U2.56), SH5 - ARMCONTROLS (C28.2 R31.2)
NetC29_2: SH2 - MCU (U2.58), SH5 - ARMCONTROLS (C29.2 R32.2)
NetC30_2: SH2 - MCU (U2.57), SH5 - ARMCONTROLS (C30.2 R34.2)
NetC31_2: SH2 - MCU (U2.54), SH5 - ARMCONTROLS (C31.2 R38.2)
NetC32_2: SH2 - MCU (U2.27), SH5 - ARMCONTROLS (C32.2 R35.2)
NetC33_2: SH2 - MCU (U2.22), SH5 - ARMCONTROLS (C33.2 R36.2)
NetC34_2: SH2 - MCU (U2.21), SH5 - ARMCONTROLS (C34.2 R39.2)
NetC35_2: SH2 - MCU (U2.10), SH5 - ARMCONTROLS (C35.2 R40.2)
NetC36_2: SH2 - MCU (U2.53), SH5 - ARMCONTROLS (C36.2 R43.2)
NetC37_2: SH2 - MCU (U2.28), SH5 - ARMCONTROLS (C37.2 R44.2)
NetC38_2: SH2 - MCU (U2.24), SH5 - ARMCONTROLS (C38.2 R45.2)
NetC39_2: SH2 - MCU (U2.23), SH5 - ARMCONTROLS (C39.2 R46.2)
NetC40_2: SH2 - MCU (U2.52), SH5 - ARMCONTROLS (C40.2 R48.2)
NetC41_2: SH2 - MCU (U2.51), SH5 - ARMCONTROLS (C41.2 R52.2)
NetC42_2: SH2 - MCU (U2.29), SH5 - ARMCONTROLS (C42.2 R51.2)
NetC43_2: SH2 - MCU (U2.26), SH5 - ARMCONTROLS (C43.2 R53.2)
NetC44_2: SH2 - MCU (U2.25), SH5 - ARMCONTROLS (C44.2 R54.2)
NetC45_2: SH2 - MCU (U2.40), SH6 - SCIENCECONTROLS (C45.2 R59.2)
NetC46_2: SH2 - MCU (U2.36), SH6 - SCIENCECONTROLS (C46.2 R60.2)
NetC47_2: SH2 - MCU (U2.62), SH6 - SCIENCECONTROLS (C47.2 R57.2)
NetC48_2: SH2 - MCU (U2.20), SH6 - SCIENCECONTROLS (C48.2 R61.2)
NetC49_2: SH2 - MCU (U2.17), SH6 - SCIENCECONTROLS (C49.2 R62.2)
NetC50_2: SH2 - MCU (U2.39), SH6 - SCIENCECONTROLS (C50.2 R65.2)
NetC51_2: SH2 - MCU (U2.35), SH6 - SCIENCECONTROLS (C51.2 R66.2)
NetC52_2: SH2 - MCU (U2.38), SH6 - SCIENCECONTROLS (C52.2 R69.2)
NetC53_2: SH2 - MCU (U2.34), SH6 - SCIENCECONTROLS (C53.2 R70.2)
NetC54_2: SH2 - MCU (U2.37), SH6 - SCIENCECONTROLS (C54.2 R73.2)
NetC55_2: SH2 - MCU (U2.33), SH6 - SCIENCECONTROLS (C55.2 R74.2)
USBD_N: SH2 - MCU (U2.44), SH3 - USB (R9.2 TP5.1)
USBD_P: SH2 - MCU (U2.45), SH3 - USB (R10.2 TP6.1)